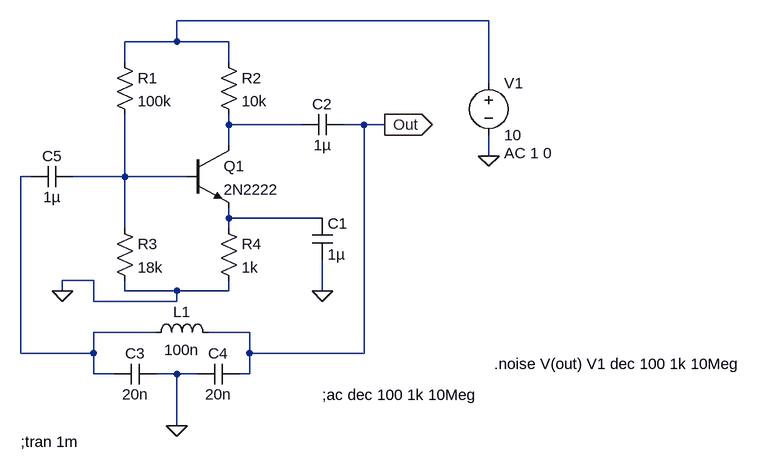
[diagram p0: schematic Final_Circuit.asc]
Final_Circuit.asc, the LTspice schematic file:
Version 4
SHEET 1 992 752
WIRE 576 16 96 16
WIRE 96 48 96 16
WIRE 96 48 16 48
WIRE 176 48 96 48
WIRE 16 80 16 48
WIRE 176 80 176 48
WIRE 576 112 576 16
WIRE 176 176 176 160
WIRE 288 176 176 176
WIRE 384 176 352 176
WIRE 416 176 384 176
WIRE 176 208 176 176
WIRE 576 224 576 192
WIRE -128 256 -144 256
WIRE 16 256 16 160
WIRE 16 256 -64 256
WIRE 112 256 16 256
WIRE 176 320 176 304
WIRE 320 320 176 320
WIRE 16 336 16 256
WIRE 176 336 176 320
WIRE -32 416 -80 416
WIRE -80 432 -80 416
WIRE 16 432 16 416
WIRE 96 432 16 432
WIRE 176 432 176 416
WIRE 176 432 96 432
WIRE 320 432 320 384
WIRE -32 448 -32 416
WIRE 96 448 96 432
WIRE 96 448 -32 448
WIRE 64 496 -32 496
WIRE 208 496 144 496
WIRE -144 528 -144 256
WIRE -32 528 -32 496
WIRE -32 528 -144 528
WIRE 208 528 208 496
WIRE 384 528 384 176
WIRE 384 528 208 528
WIRE -32 560 -32 528
WIRE 0 560 -32 560
WIRE 96 560 64 560
WIRE 128 560 96 560
WIRE 208 560 208 528
WIRE 208 560 192 560
WIRE 96 640 96 560
FLAG 96 640 0
FLAG 320 432 0
FLAG 576 224 0
FLAG -80 432 0
FLAG 416 176 Out
IOPIN 416 176 Out
SYMBOL res 0 64 R0
SYMATTR InstName R1
SYMATTR Value 100k
SYMBOL res 160 64 R0
SYMATTR InstName R2
SYMATTR Value 10k
SYMBOL npn 112 208 R0
SYMATTR InstName Q1
SYMATTR Value 2N2222
SYMBOL res 0 320 R0
SYMATTR InstName R3
SYMATTR Value 18k
SYMBOL res 160 320 R0
SYMATTR InstName R4
SYMATTR Value 1k
SYMBOL cap 304 320 R0
SYMATTR InstName C1
SYMATTR Value 1µ
SYMBOL cap 352 160 R90
WINDOW 0 0 32 VBottom 2
WINDOW 3 32 32 VTop 2
SYMATTR InstName C2
SYMATTR Value 1µ
SYMBOL cap 64 544 R90
WINDOW 0 0 32 VBottom 2
WINDOW 3 32 32 VTop 2
SYMATTR InstName C3
SYMATTR Value 20n
SYMBOL cap 192 544 R90
WINDOW 0 0 32 VBottom 2
WINDOW 3 32 32 VTop 2
SYMATTR InstName C4
SYMATTR Value 20n
SYMBOL ind 48 512 R270
WINDOW 0 32 56 VTop 2
WINDOW 3 5 56 VBottom 2
SYMATTR InstName L1
SYMATTR Value 100n
SYMBOL voltage 576 96 R0
WINDOW 123 24 124 Left 2
WINDOW 39 0 0 Left 0
SYMATTR Value2 AC 1 0
SYMATTR InstName V1
SYMATTR Value 10
SYMBOL cap -64 240 R90
WINDOW 0 0 32 VBottom 2
WINDOW 3 32 32 VTop 2
SYMATTR InstName C5
SYMATTR Value 1µ
TEXT -144 664 Left 2 !;tran 1m
TEXT 320 592 Left 2 !;ac dec 100 1k 10Meg
TEXT 584 544 Left 2 !.noise V(out) V1 dec 100 1k 10Meg

The netlist it stands for:
* Final_Circuit.asc
R1 N001 N004 100k
R2 N001 N002 10k
Q1 N002 N004 N005 0 2N2222
R3 N004 0 18k
R4 N005 0 1k
C1 N005 0 1µ
C2 Out N002 1µ
C3 0 N003 20n
C4 Out 0 20n
L1 N003 Out 100n
V1 N001 0 10 AC 1 0
C5 N004 N003 1µ
.model NPN NPN
.model PNP PNP
.lib standard.bjt
;tran 1m
;ac dec 100 1k 10Meg
.noise V(out) V1 dec 100 1k 10Meg
.backanno
.end